# Altium schematic sheet 19 HDMI.SchDoc
size 420 x 297 mm
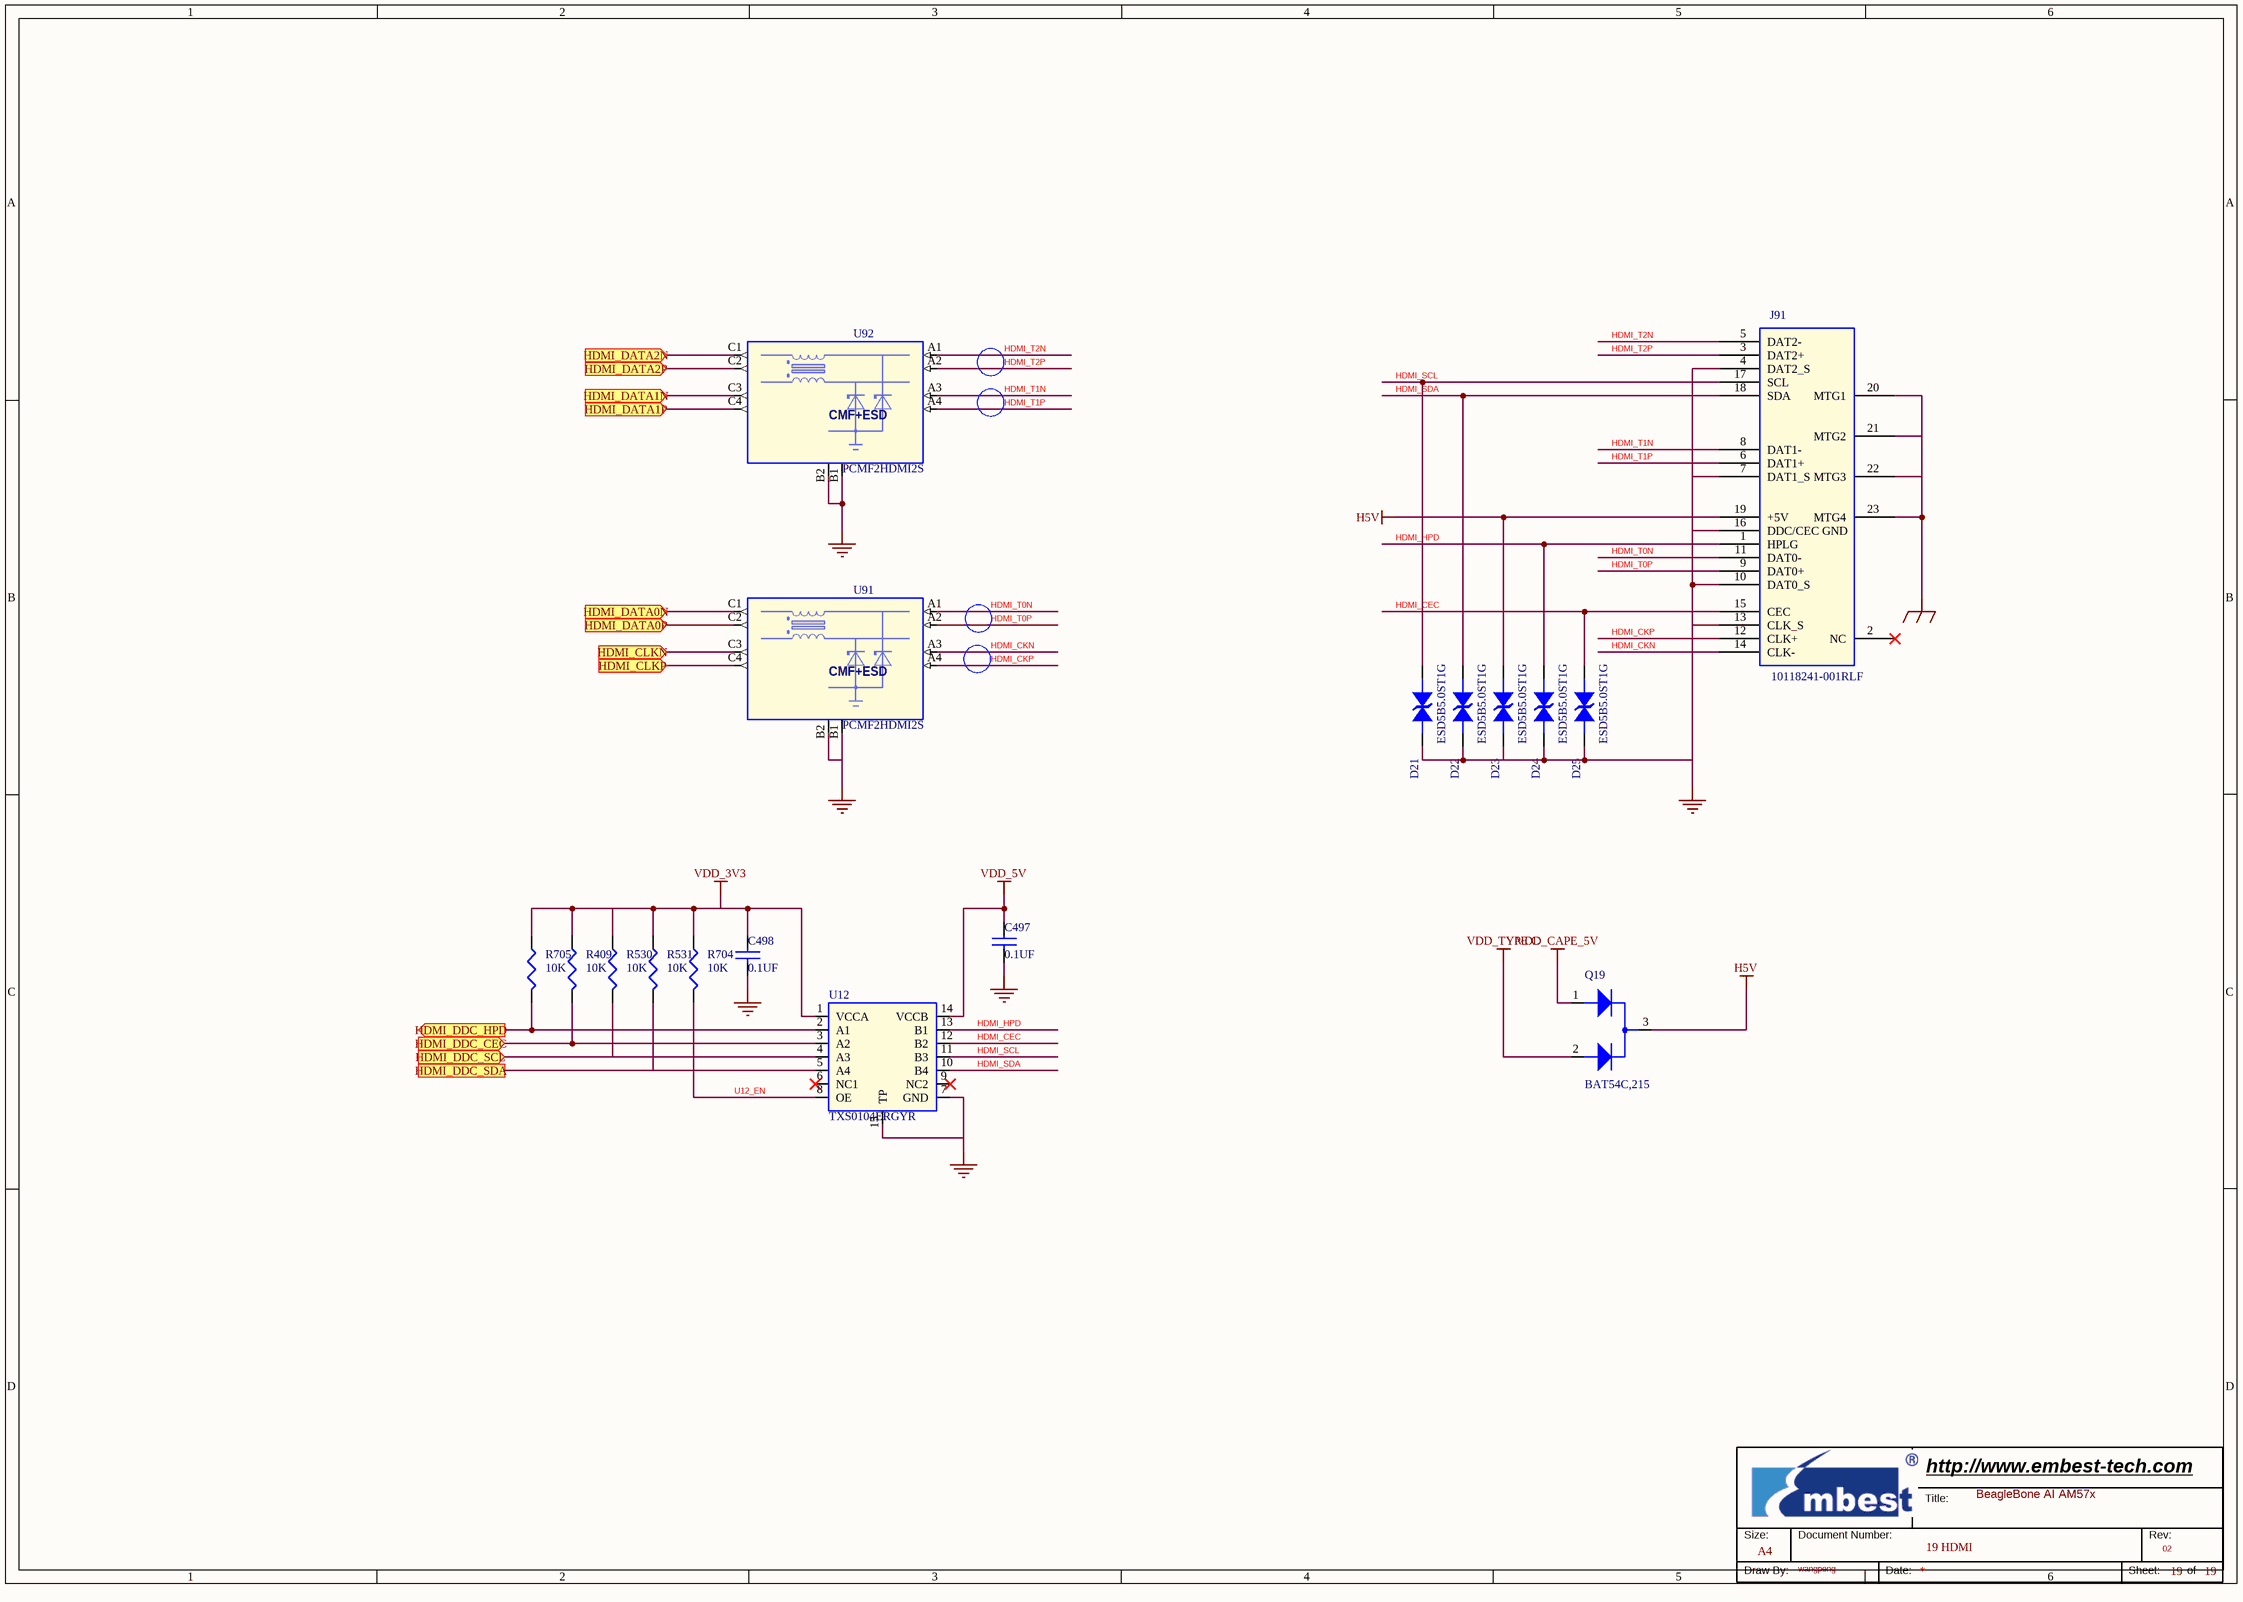
[diagram p0: 19 HDMI.SchDoc]

## Parts
*  Page Count: 19  Page Size: A4  Title: BeagleBone AI AM57x  RevCode: 02  Doc: 19 HDMI  Drawing: wangpeng  (hidden comment: Embest Title)  (graphical)
C497  0.1UF  [C0402]
C498  0.1UF  [C0402]
D21  ESD5B5.0ST1G  [SODFL1608x70N]
D22  ESD5B5.0ST1G  [SODFL1608x70N]
D23  ESD5B5.0ST1G  [SODFL1608x70N]
D24  ESD5B5.0ST1G  [SODFL1608x70N]
D25  ESD5B5.0ST1G  [SODFL1608x70N]
J91  10118241-001RLF  [hdmis19_4p4]
Q19  BAT54C,215  [sot23_123]
R409  10K  [R0402]
R530  10K  [R0402]
R531  10K  [R0402]
R704  10K  [R0402]
R705  10K  [R0402]
U12  TXS0104ERGYR  [qfn50p350x350x100-15n]
U91  PCMF2HDMI2S  [WLCSP10C40p3x4_117x157x60N]
U92  PCMF2HDMI2S  [WLCSP10C40p3x4_117x157x60N]

## Ports
HDMI_CLKN (in), HDMI_CLKP (in), HDMI_DATA0N (in), HDMI_DATA0P (in), HDMI_DATA1N (in), HDMI_DATA1P (in), HDMI_DATA2N (in), HDMI_DATA2P (in), HDMI_DDC_CEC (in), HDMI_DDC_HPD (out), HDMI_DDC_SCL (in), HDMI_DDC_SDA

## Nets
GND: C497.2 C498.2 D21.1 D22.1 D23.1 D24.1 D25.1 J91.4(DAT2_S) J91.7(DAT1_S) J91.10(DAT0_S) J91.13(CLK_S) J91.16(DDC/CEC_GND) U12.7(GND) U12.15(TP) U91.B1(GND_CH1) U91.B2(GND_CH2) U92.B1(GND_CH1) U92.B2(GND_CH2)
GND_EARTH: J91.20(MTG1) J91.21(MTG2) J91.22(MTG3) J91.23(MTG4)
H5V: D23.2 J91.19(+5V) Q19.3
VDD_3V3: C498.1 R409.1 R530.1 R531.1 R704.1 R705.1 U12.1(VCCA)
VDD_5V: C497.1 U12.14(VCCB)
VDD_CAPE_5V: Q19.1
VDD_TYPE C: Q19.2
HDMI_CEC: D25.2 J91.15(CEC) U12.12(B2)
HDMI_CKN: J91.14(CLK-) U91.A3(CH2_IN+)
HDMI_CKP: J91.12(CLK+) U91.A4(CH2_IN-)
HDMI_CLKN: U91.C3(CH2_OUT+) ; port HDMI_CLKN
HDMI_CLKP: U91.C4(CH2_OUT-) ; port HDMI_CLKP
HDMI_DATA0N: U91.C1(CH1_OUT+) ; port HDMI_DATA0N
HDMI_DATA0P: U91.C2(CH1_OUT-) ; port HDMI_DATA0P
HDMI_DATA1N: U92.C3(CH2_OUT+) ; port HDMI_DATA1N
HDMI_DATA1P: U92.C4(CH2_OUT-) ; port HDMI_DATA1P
HDMI_DATA2N: U92.C1(CH1_OUT+) ; port HDMI_DATA2N
HDMI_DATA2P: U92.C2(CH1_OUT-) ; port HDMI_DATA2P
HDMI_DDC_CEC: R409.2 U12.3(A2) ; port HDMI_DDC_CEC
HDMI_DDC_HPD: R705.2 U12.2(A1) ; port HDMI_DDC_HPD
HDMI_DDC_SCL: R530.2 U12.4(A3) ; port HDMI_DDC_SCL
HDMI_DDC_SDA: R531.2 U12.5(A4) ; port HDMI_DDC_SDA
HDMI_HPD: D24.2 J91.1(HPLG) U12.13(B1)
HDMI_SCL: D21.2 J91.17(SCL) U12.11(B3)
HDMI_SDA: D22.2 J91.18(SDA) U12.10(B4)
HDMI_T0N: J91.11(DAT0-) U91.A1(CH1_IN+)
HDMI_T0P: J91.9(DAT0+) U91.A2(CH1_IN-)
HDMI_T1N: J91.8(DAT1-) U92.A3(CH2_IN+)
HDMI_T1P: J91.6(DAT1+) U92.A4(CH2_IN-)
HDMI_T2N: J91.5(DAT2-) U92.A1(CH1_IN+)
HDMI_T2P: J91.3(DAT2+) U92.A2(CH1_IN-)
U12_EN: R704.2 U12.8(OE)

Not connected (* = marked no-connect by the designer): J91 2(NC)*; U12 6(NC1)* 9(NC2)*

## Notes on the sheet
- (in symbol Embest Title) Title:; Size:; Document Number:; Rev:; Draw By:; Date:; Sheet:; of
- (in symbol PCMF2HDMI2S) CMF+ESD

## Library data of the parts
C497 C498 = C: CAP,100NF,+/-10%,X7R,16V,SMD0402; Manufacturer: Murata; Manufacturer Part Number: GRM155R71C104KA88D; Embest PN: 1004001100047; Part Type: Ceramic Capacitor; Datasheet: Y:\ÐÂK3ÏµÍ³ÎïÁÏdatasheet\[1003_1004]capacitor-resistor µçÈÝ¡¢µç×è\1004001100047-GRM155R71C104KA88D.pdf
D21-D25 = Diode TVS Dual: Diode,TVS,ESD5B5.0ST1G,5V,50W,SOD-523,SMD; Manufacturer: ON; Embest PN: 1006005100019; Part Type: Diode; Manufacturer Part Number: ESD5B5.0ST1G; Status: BeagleBone AI; Datasheet: Y:\ÐÂK3ÏµÍ³ÎïÁÏdatasheet\[1006002~013]diodes-transistors ¶þÈý¼«¹Ü\1006005100019_ESD5B5.0ST1G_ON
J91 = hdmis19_4p4: Connector,HDMI Receptacle, Type D, Right Angle,DIP+ SMT leg; Manufacturer: FCI; Embest PN: 1009008100005; Part Type: HDMI Connector; Manufacturer Part Number: 10118241-001RLF; Status: BB-Black(AM437x)
Q19 = Diode dual_cc: Diode,Schottky Barrier(Double) Diodes,BAT54C,215,30V,200mA,SOT-23,SMD; Manufacturer: NXP; Embest PN: 1006003100004; Datasheet: Y:\ÐÂK3ÏµÍ³ÎïÁÏdatasheet\[1006002~013]diodes-transistors ¶þÈý¼«¹Ü\1006003100004 BAT54C 215.pdf; Manufacturer Part Number: BAT54C,215; Part Type: Diode
R409 R704 R705 = R: RES,10K,+/-1%,1/16W,SMD0402; Manufacturer: YAGEO; Manufacturer Part Number: RC0402FR-0710KL; Embest PN: 1003001100071; Part Type: Thick film Resistor
R530 R531 = R: RES,10K,+/-1%,1/16W,SMD0402; Manufacturer Part Number: RC0402FR-0710KL; Manufacturer: YAGEO; Embest PN: 1003001100071; Part Type: Thick film Resistor
U12 = TXS0104ERGYR: IC,TXS0104E 4-Bit Bidirectional Voltage-Level Translator For Open-Drain and Push-PullApplications 14-QFN,SMD; Manufacturer: TI; Embest PN: 1002008100180; Datasheet: Y:\ÐÂK3ÏµÍ³ÎïÁÏdatasheet\[1002]IC ¼¯³ÉµçÂ·\1002008100180 TXS0104ERGYR.pdf; Status: som-sm9300; Manufacturer Part Number: TXS0104ERGYR; Part Type: Logic
U91 U92 = PCMF2HDMI2S: EMI filter with integrated ElectroStatic Discharge protection two differential channels,PCMF2HDMI2S,SMD; Manufacturer: Nexperia; CLASS: IC; Embest PN: 1013002100030; Status: IMX 8; Manufacturer Part Number: PCMF2HDMI2S; Part Type: Filter
* = Embest Title: Page Number: 19; Page Create Date: May 29, 2006; WebSite: http://www.embest-tech.com; Company: Embest; Page Modify Date: *